# Altium schematic sheet Interconnect.SchDoc
size A4
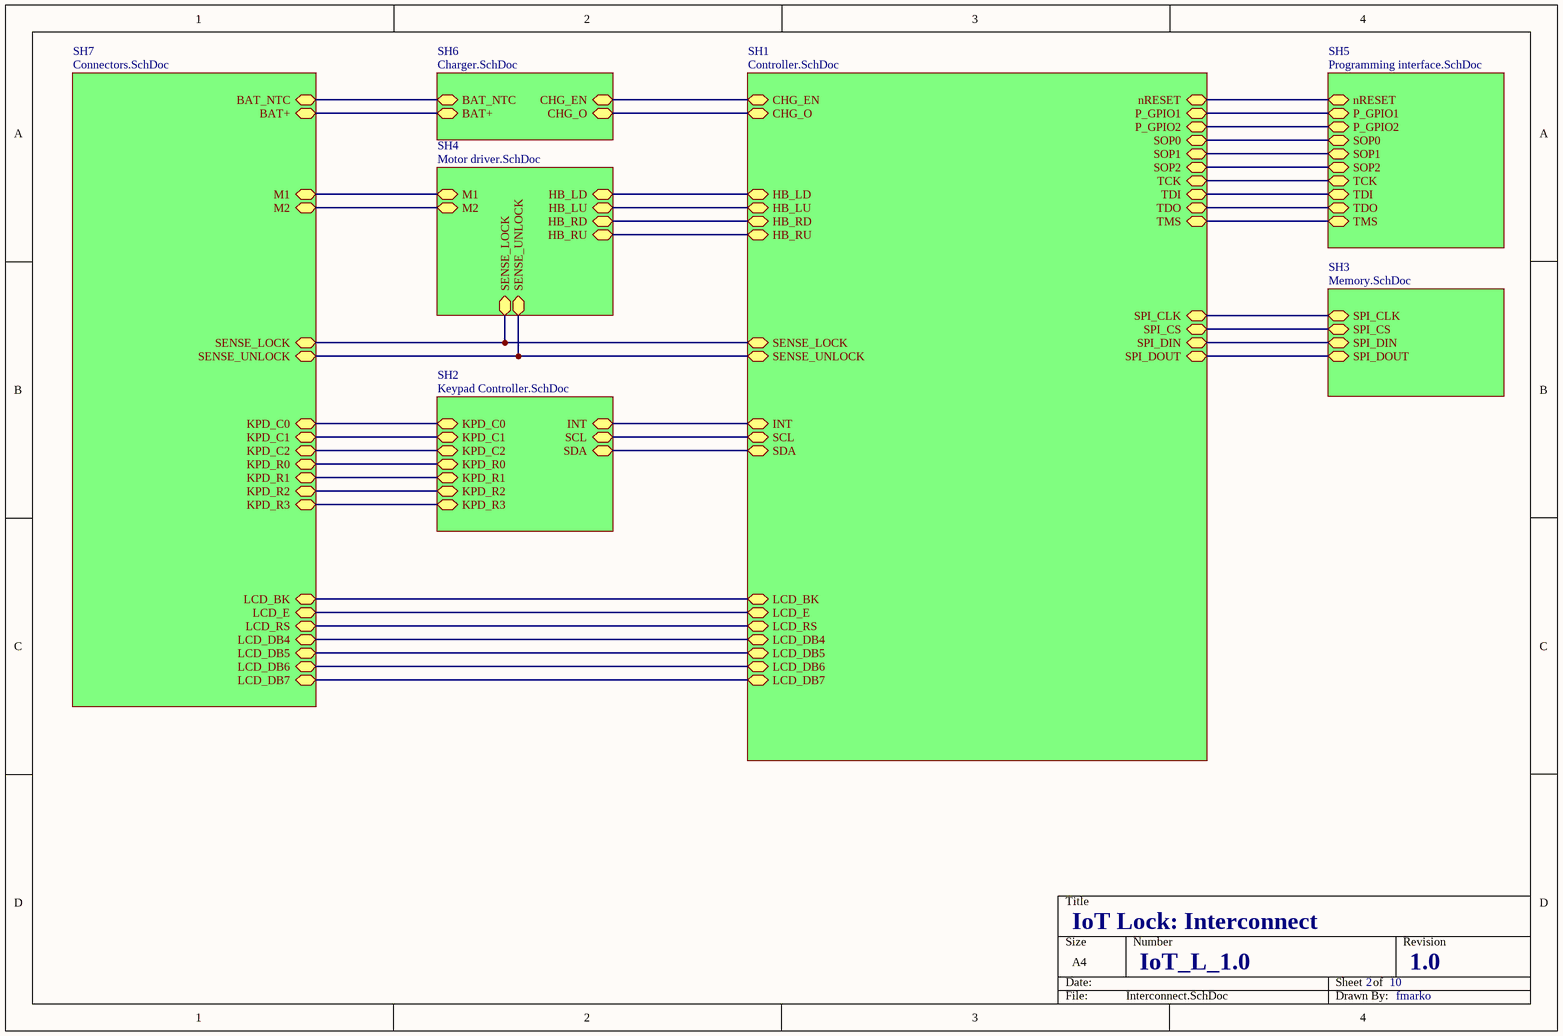
[diagram p0: Interconnect.SchDoc]

## Sub-sheets
SH1 = Controller.SchDoc: CHG_EN, CHG_O, HB_LD, HB_RD, HB_LU, HB_RU, INT, LCD_BK, LCD_DB4, LCD_DB5, LCD_DB6, LCD_DB7, LCD_E, LCD_RS, nRESET, P_GPIO1, P_GPIO2, SCL, SDA, SENSE_LOCK, SENSE_UNLOCK, SOP1, SOP0, SOP2, SPI_CLK, SPI_CS, SPI_DIN, SPI_DOUT, TCK, TDI, TDO, TMS
SH2 = Keypad Controller.SchDoc: INT, KPD_C0, KPD_C1, KPD_C2, KPD_R0, KPD_R1, KPD_R2, KPD_R3, SCL, SDA
SH3 = Memory.SchDoc: SPI_CLK, SPI_CS, SPI_DIN, SPI_DOUT
SH4 = Motor driver.SchDoc: HB_LD, HB_LU, HB_RD, HB_RU, M1, M2, SENSE_LOCK, SENSE_UNLOCK
SH5 = Programming interface.SchDoc: nRESET, P_GPIO1, P_GPIO2, SOP0, SOP2, SOP1, TCK, TDI, TDO, TMS
SH6 = Charger.SchDoc: BAT+, BAT_NTC, CHG_O, CHG_EN
SH7 = Connectors.SchDoc: BAT+, BAT_NTC, KPD_C0, KPD_C1, KPD_R0, KPD_C2, KPD_R1, KPD_R2, KPD_R3, LCD_BK, LCD_DB4, LCD_DB5, LCD_DB6, LCD_DB7, LCD_E, LCD_RS, M1, M2, SENSE_LOCK, SENSE_UNLOCK

## Nets
(unnamed): sheet SH1/CHG_EN, sheet SH6/CHG_EN
(unnamed): sheet SH1/CHG_O, sheet SH6/CHG_O
(unnamed): sheet SH1/HB_LD, sheet SH4/HB_LD
(unnamed): sheet SH1/HB_RD, sheet SH4/HB_RD
(unnamed): sheet SH1/HB_LU, sheet SH4/HB_LU
(unnamed): sheet SH1/HB_RU, sheet SH4/HB_RU
(unnamed): sheet SH1/INT, sheet SH2/INT
(unnamed): sheet SH1/LCD_BK, sheet SH7/LCD_BK
(unnamed): sheet SH1/LCD_DB4, sheet SH7/LCD_DB4
(unnamed): sheet SH1/LCD_DB5, sheet SH7/LCD_DB5
(unnamed): sheet SH1/LCD_DB6, sheet SH7/LCD_DB6
(unnamed): sheet SH1/LCD_DB7, sheet SH7/LCD_DB7
(unnamed): sheet SH1/LCD_E, sheet SH7/LCD_E
(unnamed): sheet SH1/LCD_RS, sheet SH7/LCD_RS
(unnamed): sheet SH1/nRESET, sheet SH5/nRESET
(unnamed): sheet SH1/P_GPIO1, sheet SH5/P_GPIO1
(unnamed): sheet SH1/P_GPIO2, sheet SH5/P_GPIO2
(unnamed): sheet SH1/SCL, sheet SH2/SCL
(unnamed): sheet SH1/SDA, sheet SH2/SDA
(unnamed): sheet SH1/SENSE_LOCK, sheet SH4/SENSE_LOCK, sheet SH7/SENSE_LOCK
(unnamed): sheet SH1/SENSE_UNLOCK, sheet SH4/SENSE_UNLOCK, sheet SH7/SENSE_UNLOCK
(unnamed): sheet SH1/SOP1, sheet SH5/SOP1
(unnamed): sheet SH1/SOP0, sheet SH5/SOP0
(unnamed): sheet SH1/SOP2, sheet SH5/SOP2
(unnamed): sheet SH1/SPI_CLK, sheet SH3/SPI_CLK
(unnamed): sheet SH1/SPI_CS, sheet SH3/SPI_CS
(unnamed): sheet SH1/SPI_DIN, sheet SH3/SPI_DIN
(unnamed): sheet SH1/SPI_DOUT, sheet SH3/SPI_DOUT
(unnamed): sheet SH1/TCK, sheet SH5/TCK
(unnamed): sheet SH1/TDI, sheet SH5/TDI
(unnamed): sheet SH1/TDO, sheet SH5/TDO
(unnamed): sheet SH1/TMS, sheet SH5/TMS
(unnamed): sheet SH2/KPD_C0, sheet SH7/KPD_C0
(unnamed): sheet SH2/KPD_C1, sheet SH7/KPD_C1
(unnamed): sheet SH2/KPD_C2, sheet SH7/KPD_C2
(unnamed): sheet SH2/KPD_R0, sheet SH7/KPD_R0
(unnamed): sheet SH2/KPD_R1, sheet SH7/KPD_R1
(unnamed): sheet SH2/KPD_R2, sheet SH7/KPD_R2
(unnamed): sheet SH2/KPD_R3, sheet SH7/KPD_R3
(unnamed): sheet SH4/M1, sheet SH7/M1
(unnamed): sheet SH4/M2, sheet SH7/M2
(unnamed): sheet SH6/BAT+, sheet SH7/BAT+
(unnamed): sheet SH6/BAT_NTC, sheet SH7/BAT_NTC

## Notes on the sheet
- IoT Lock: Interconnect
- IoT_L_1.0
- 2
- 10
- 1.0
- fmarko